# EAGLE schematic App_Board_V1.2_Colored (EAGLE 7.1.0)
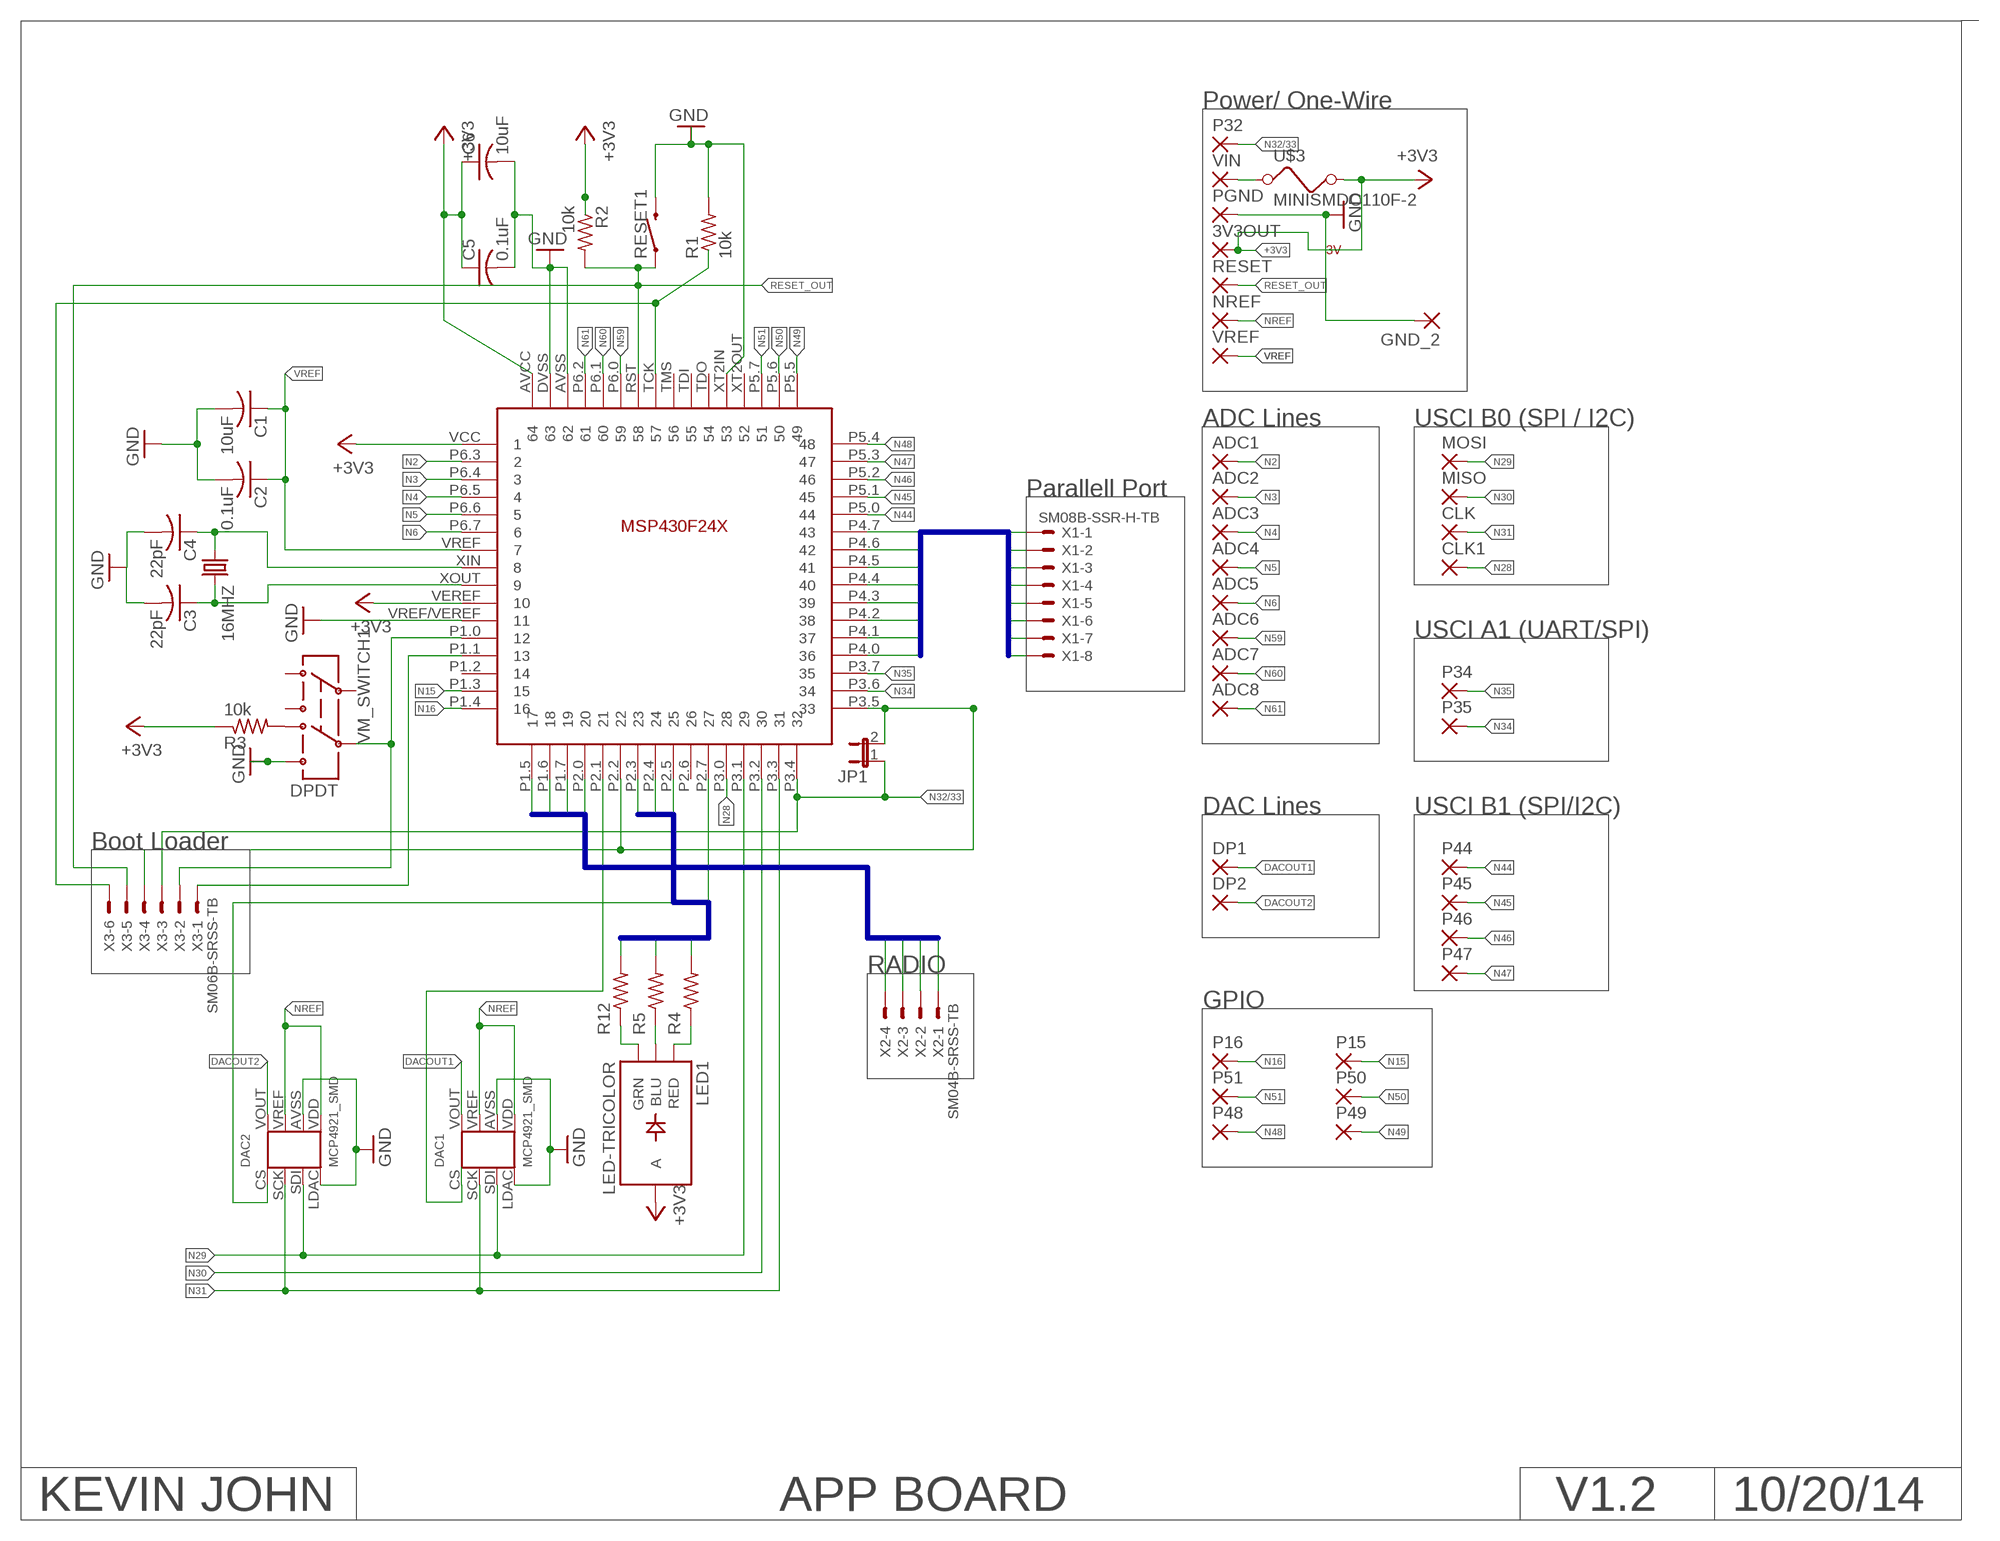
[diagram p0: schematic, sheet 1]

## Parts
3V3OUT  1,6/0,9  [1,6/0,9]
16MHZ  CRYSTAL5X3  [CRYSTAL-SMD-5X3]
ADC1  1,6/0,9  [1,6/0,9]
ADC2  1,6/0,9  [1,6/0,9]
ADC3  1,6/0,9  [1,6/0,9]
ADC4  1,6/0,9  [1,6/0,9]
ADC5  1,6/0,9  [1,6/0,9]
ADC6  1,6/0,9  [1,6/0,9]
ADC7  1,6/0,9  [1,6/0,9]
ADC8  1,6/0,9  [1,6/0,9]
C1  10uF  C-USC0805  [C0805]
C2  0.1uF  C-USC0805  [C0805]
C3  22pF  C-USC0805  [C0805]
C4  22pF  C-USC0805  [C0805]
C5  0.1uF  C-USC0805  [C0805]
C6  10uF  C-USC1210  [C1210]
CLK  1,6/0,9  [1,6/0,9]
CLK1  1,6/0,9  [1,6/0,9]
DAC1  MCP4921_SMD  [MCP4921_SMD]
DAC2  MCP4921_SMD  [MCP4921_SMD]
DP1  1,6/0,9  [1,6/0,9]
DP2  1,6/0,9  [1,6/0,9]
GND_2  1,6/0,9  [1,6/0,9]
JP1  JP1E  [JP1]
LED1  LED-TRICOLOR  [LED-TRICOLOR-SMD]
MISO  1,6/0,9  [1,6/0,9]
MOSI  1,6/0,9  [1,6/0,9]
NREF  1,6/0,9  [1,6/0,9]
P15  1,6/0,9  [1,6/0,9]
P16  1,6/0,9  [1,6/0,9]
P32  1,6/0,9  [1,6/0,9]
P34  1,6/0,9  [1,6/0,9]
P35  1,6/0,9  [1,6/0,9]
P44  1,6/0,9  [1,6/0,9]
P45  1,6/0,9  [1,6/0,9]
P46  1,6/0,9  [1,6/0,9]
P47  1,6/0,9  [1,6/0,9]
P48  1,6/0,9  [1,6/0,9]
P49  1,6/0,9  [1,6/0,9]
P50  1,6/0,9  [1,6/0,9]
P51  1,6/0,9  [1,6/0,9]
PGND  1,6/0,9  [1,6/0,9]
R1  10k  R-US_R0603  [R0603]
R2  10k  R-US_R0603  [R0603]
R3  10k  R-US_R0603  [R0603]
R4  100  R-US_R0603  [R0603]
R5  100  R-US_R0603  [R0603]
R12  100  R-US_R0603  [R0603]
RESET  1,6/0,9  [1,6/0,9]
RESET1  SWITCH-MOMENTARY-2SMD  [TACTILE_SWITCH_SMD]
U$1  MSP430  [MSP430]
U$3  MINISMDC110F-2  [MINISMDC110]
VIN  1,6/0,9  [1,6/0,9]
VM_SWITCH1  DPDT  SWITCH-DPDTAYZ0202  [AYZ0202]
VREF  1,6/0,9  [1,6/0,9]
X1  SM08B-SSR-H-TB  [SM08B-SSR-H-TB]
X2  SM04B-SRSS-TB  [SM04B-SRSS-TB]
X3  SM06B-SRSS-TB  [SM06B-SRSS-TB]

## Nets
3.3VOUT: U$3.P$1 VIN.1(P)
+3V3: 3V3OUT.1(P) C5.1 C6.1 LED1.A R2.1 R3.1 U$1.AVCC U$1.VCC U$1.VEREF U$3.P$2
DACOUT1: DAC1.VOUT DP1.1(P)
DACOUT2: DAC2.VOUT DP2.1(P)
GND [Standard]: C1.2 C2.2 C3.2 C4.2 C5.2 C6.2 DAC1.AVSS(VCC) DAC1.LDAC(LADC) DAC2.AVSS(VCC) DAC2.LDAC(LADC) GND_2.1(P) PGND.1(P) R1.2 RESET1.3 U$1.AVSS U$1.DVSS U$1.VREF/VEREF U$1.XT2IN VM_SWITCH1.6
LED0: R5.2 U$1.P2.3
LED1: R12.2 U$1.P2.4
LED2: R4.2 U$1.P2.5
N2: ADC1.1(P) U$1.P6.3
N3: ADC2.1(P) U$1.P6.4
N4: ADC3.1(P) U$1.P6.5
N5: ADC4.1(P) U$1.P6.6
N6: ADC5.1(P) U$1.P6.7
N15: P15.1(P) U$1.P1.3
N16: P16.1(P) U$1.P1.4
N20: DAC2.CS U$1.P2.7
N28: CLK1.1(P) U$1.P3.0
N29: DAC1.SDI DAC2.SDI MOSI.1(P) U$1.P3.1
N30: MISO.1(P) U$1.P3.2
N31: CLK.1(P) DAC1.SCK DAC2.SCK U$1.P3.3
N32: JP1.2 U$1.P2.2 U$1.P3.5 X3.4
N32/33: JP1.1 P32.1(P) U$1.P3.4 X3.3
N34: P35.1(P) U$1.P3.6
N35: P34.1(P) U$1.P3.7
N44: P44.1(P) U$1.P5.0
N45: P45.1(P) U$1.P5.1
N46: P46.1(P) U$1.P5.2
N47: P47.1(P) U$1.P5.3
N48: P48.1(P) U$1.P5.4
N49: P49.1(P) U$1.P5.5
N50: P50.1(P) U$1.P5.6
N51: P51.1(P) U$1.P5.7
N59: ADC6.1(P) U$1.P6.0
N60: ADC7.1(P) U$1.P6.1
N61: ADC8.1(P) U$1.P6.2
N$3: 16MHZ.1 C4.1 U$1.XIN
N$5: R3.2 VM_SWITCH1.4
N$6: LED1.G(GRN) R12.1
N$7: LED1.B(BLU) R5.1
N$8: LED1.R(RED) R4.1
N$12: U$1.P1.0 VM_SWITCH1.5 X3.2
N$13: DAC1.CS U$1.P2.1
N$14: 16MHZ.3 C3.1 U$1.XOUT
N$15: U$1.P1.1 X3.1
NREF: DAC1.VDD DAC1.VREF DAC2.VDD DAC2.VREF NREF.1(P)
RADIO0: U$1.P1.5 X2.4
RADIO1: U$1.P1.6 X2.3
RADIO2: U$1.P1.7 X2.2
RADIO3: U$1.P2.0 X2.1
RESET_OUT: R2.2 RESET1.1 RESET.1(P) U$1.RST X3.5
RTS1: R1.1 U$1.TCK X3.6
SERIAL0: U$1.P4.7 X1.1
SERIAL1: U$1.P4.6 X1.2
SERIAL2: U$1.P4.5 X1.3
SERIAL3: U$1.P4.4 X1.4
SERIAL4: U$1.P4.3 X1.5
SERIAL5: U$1.P4.2 X1.6
SERIAL6: U$1.P4.1 X1.7
SERIAL7: U$1.P4.0 X1.8
VREF [Standard]: C1.1 C2.1 U$1.VREF VREF.1(P)
Unconnected: U$1.P1.2 U$1.P2.6 U$1.TDI U$1.TDO U$1.TMS U$1.XT2OUT VM_SWITCH1.1 VM_SWITCH1.2 VM_SWITCH1.3

## Buses
SERIAL[0..7]
RADIO[0..3]
LED[0..2]

## Notes on the sheet
- Power/ One-Wire
- 3V
- ADC Lines | USCI B0 (SPI / I2C)
- Parallell Port
- USCI A1 (UART/SPI)
- DAC Lines | USCI B1 (SPI/I2C)
- Boot Loader
- RADIO
- GPIO
- KEVIN JOHN | APP BOARD | V1.2 | 10/20/14

## Library data of the parts
3V3OUT ADC1-ADC8 CLK CLK1 DP1 DP2 GND_2 MISO MOSI NREF P15 P16 P32 P34 P35 P44-P51 PGND RESET VIN VREF = wirepad:1,6/0,9: THROUGH-HOLE PAD
16MHZ = SparkFun-FreqCtrl:CRYSTAL: Various standard crystals. Proven footprints. Spark Fun Electronics SKU : COM-00534
C1-C6 = rcl:C-US: CAPACITOR, American symbol
DAC1 DAC2 = PocketCube:MCP4921_SMD
JP1 = jumper:JP1E: JUMPER
LED1 = SparkFun-LED:LED-TRICOLOR: Tri-Color LED SMD Proven layout and schematic for triple color LED in SMD package - common anode. Spark Fun Electronics SKU : COM-07844
R1-R5 R12 = rcl:R-US_: RESISTOR, American symbol
RESET1 = SparkFun-Electromechanical:SWITCH-MOMENTARY-2: Various NO switches- pushbuttons, reed, etc
U$1 = LearningByMaking:MSP430
U$3 = LearningByMaking:MINISMDC110F-2
VM_SWITCH1 = SparkFun-Electromechanical:SWITCH-DPDT: DPDT Version of the COM-00597; PROD_ID: SWCH-08179
X1 = con-jst2:SM08B-SSR-H-TB: Disconnectable Insulation displacement connector, 1.0mm pitch 8 contacts
X2 = con-jst2:?M04B-SRSS-TB: Disconnectable Crimp style connector, 1.0mm pitch 4 contacts
X3 = con-jst2:?M06B-SRSS-TB: Disconnectable Crimp style connector, 1.0mm pitch 6 contacts

## Net classes
1 Standard: width 0.152 mm, drill 0.152 mm, clearance 0.152 mm